# Altium schematic sheet Multipler.SchDoc
size A
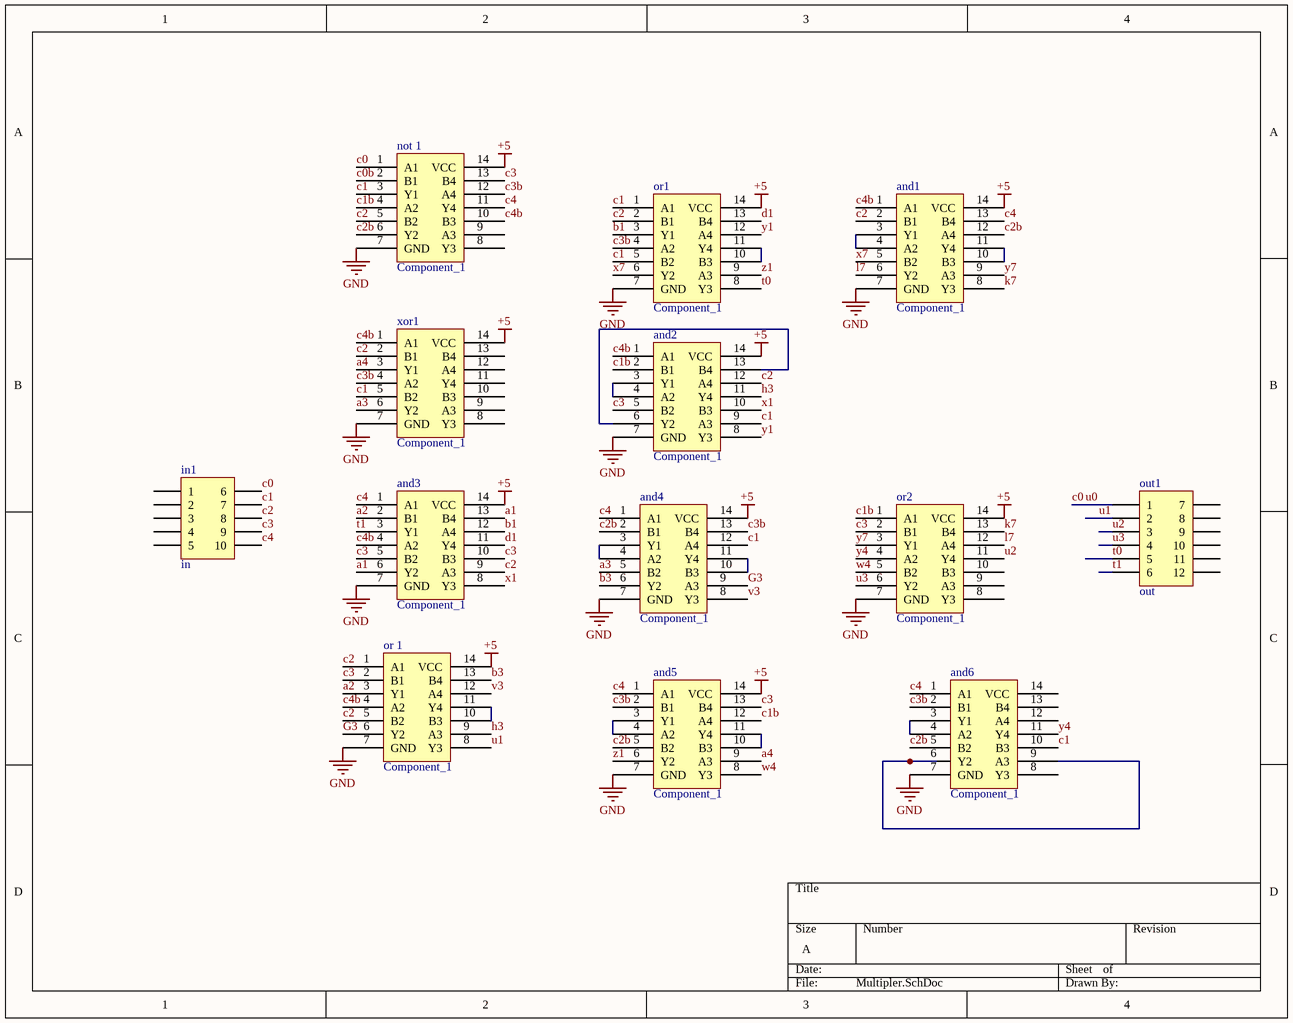
[diagram p0: Multipler.SchDoc]

## Parts
and1  Component_1  [PCBComponent_1]
and2  Component_1  [PCBComponent_1]
and3  Component_1  [PCBComponent_1]
and4  Component_1  [PCBComponent_1]
and5  Component_1  [PCBComponent_1]
and6  Component_1  [PCBComponent_1]
in1  in  [HDR2X5_CEN]
not_1  Component_1  [PCBComponent_1]
or1  Component_1  [PCBComponent_1]
or2  Component_1  [PCBComponent_1]
or_1  Component_1  [PCBComponent_1]
out1  out  [HDR2X6_CEN]
xor1  Component_1  [PCBComponent_1]

## Nets
+5: and1.14(VCC) and2.14(VCC) and3.14(VCC) and4.14(VCC) and5.14(VCC) not_1.14(VCC) or1.14(VCC) or2.14(VCC) or_1.14(VCC) xor1.14(VCC)
GND: and1.7(GND) and2.7(GND) and3.7(GND) and4.7(GND) and5.7(GND) and6.7(GND) not_1.7(GND) or1.7(GND) or2.7(GND) or_1.7(GND) xor1.7(GND)
a1: and3.6(Y2) and3.13(B4)
a2: and3.2(B1) or_1.3(Y1)
a3: and4.5(B2) xor1.6(Y2)
a4: and5.9(A3) xor1.3(Y1)
b1: and3.12(A4) or1.3(Y1)
b3: and4.6(Y2) or_1.13(B4)
c0: in1.6 not_1.1(A1) out1.1  [also labelled u0]
c0b: not_1.2(B1)
c1: and2.9(A3) and4.12(A4) and6.10(B3) in1.7 not_1.3(Y1) or1.1(A1) or1.5(B2) xor1.5(B2)
c1b: and2.2(B1) and5.12(A4) not_1.4(A2) or2.1(A1)
c2: and1.2(B1) and2.12(A4) and3.9(A3) in1.8 not_1.5(B2) or1.2(B1) or_1.1(A1) or_1.5(B2) xor1.2(B1)
c2b: and1.12(A4) and4.2(B1) and5.5(B2) and6.5(B2) not_1.6(Y2)
c3: and2.5(B2) and3.5(B2) and3.10(B3) and5.13(B4) in1.9 not_1.13(B4) or2.2(B1) or_1.2(B1)
c3b: and4.13(B4) and5.2(B1) and6.2(B1) not_1.12(A4) or1.4(A2) xor1.4(A2)
c4: and1.13(B4) and3.1(A1) and4.1(A1) and5.1(A1) and6.1(A1) in1.10 not_1.11(Y4)
c4b: and1.1(A1) and2.1(A1) and3.4(A2) not_1.10(B3) or_1.4(A2) xor1.1(A1)
d1: and3.11(Y4) or1.13(B4)
G3: and4.9(A3) or_1.6(Y2)
h3: and2.11(Y4) or_1.9(A3)
k7: and1.8(Y3) or2.13(B4)
l7: and1.6(Y2) or2.12(A4)
t0: or1.8(Y3) out1.5
t1: and3.3(Y1) out1.6
u1: or_1.8(Y3) out1.2
u2: or2.11(Y4) out1.3
u3: or2.6(Y2) out1.4
v3: and4.8(Y3) or_1.12(A4)
w4: and5.8(Y3) or2.5(B2)
x1: and2.10(B3) and3.8(Y3)
x7: and1.5(B2) or1.6(Y2)
y1: and2.8(Y3) or1.12(A4)
y4: and6.11(Y4) or2.4(A2)
y7: and1.9(A3) or2.3(Y1)
z1: and5.6(Y2) or1.9(A3)
Netand1_3: and1.3(Y1) and1.4(A2)
Netand1_10: and1.10(B3) and1.11(Y4)
Netand2_3: and2.3(Y1) and2.4(A2)
Netand2_6: and2.6(Y2) and2.13(B4)
Netand4_3: and4.3(Y1) and4.4(A2)
Netand4_10: and4.10(B3) and4.11(Y4)
Netand5_3: and5.3(Y1) and5.4(A2)
Netand5_10: and5.10(B3) and5.11(Y4)
Netand6_3: and6.3(Y1) and6.4(A2)
Netand6_6: and6.6(Y2) and6.9(A3)
Netor1_10: or1.10(B3) or1.11(Y4)
Netor_1_10: or_1.10(B3) or_1.11(Y4)

Not connected (* = marked no-connect by the designer): and6 8(Y3) 12(A4) 13(B4) 14(VCC); in1 1 2 3 4 5; not_1 8(Y3) 9(A3); or2 8(Y3) 9(A3) 10(B3); out1 7 8 9 10 11 12; xor1 8(Y3) 9(A3) 10(B3) 11(Y4) 12(A4) 13(B4)

## Library data of the parts
in1 = Header 5X2A: Header, 5-Pin, Dual row; LatestRevisionDate: 17-Jul-2002; LatestRevisionNote: Re-released for DXP Platform.; Publisher: Altium Limited
out1 = Header 6X2A: Header, 6-Pin, Dual row; LatestRevisionDate: 17-Jul-2002; LatestRevisionNote: Re-released for DXP Platform.; Publisher: Altium Limited